# EasyEDA schematic SCH_Light-Meter-Schematic_2025-04-22 (1).json
TITLE: Light Meter Schematic; REV: 1.0; Date: 2025-03-17; Sheet: 1/1; Company: Bobi Company
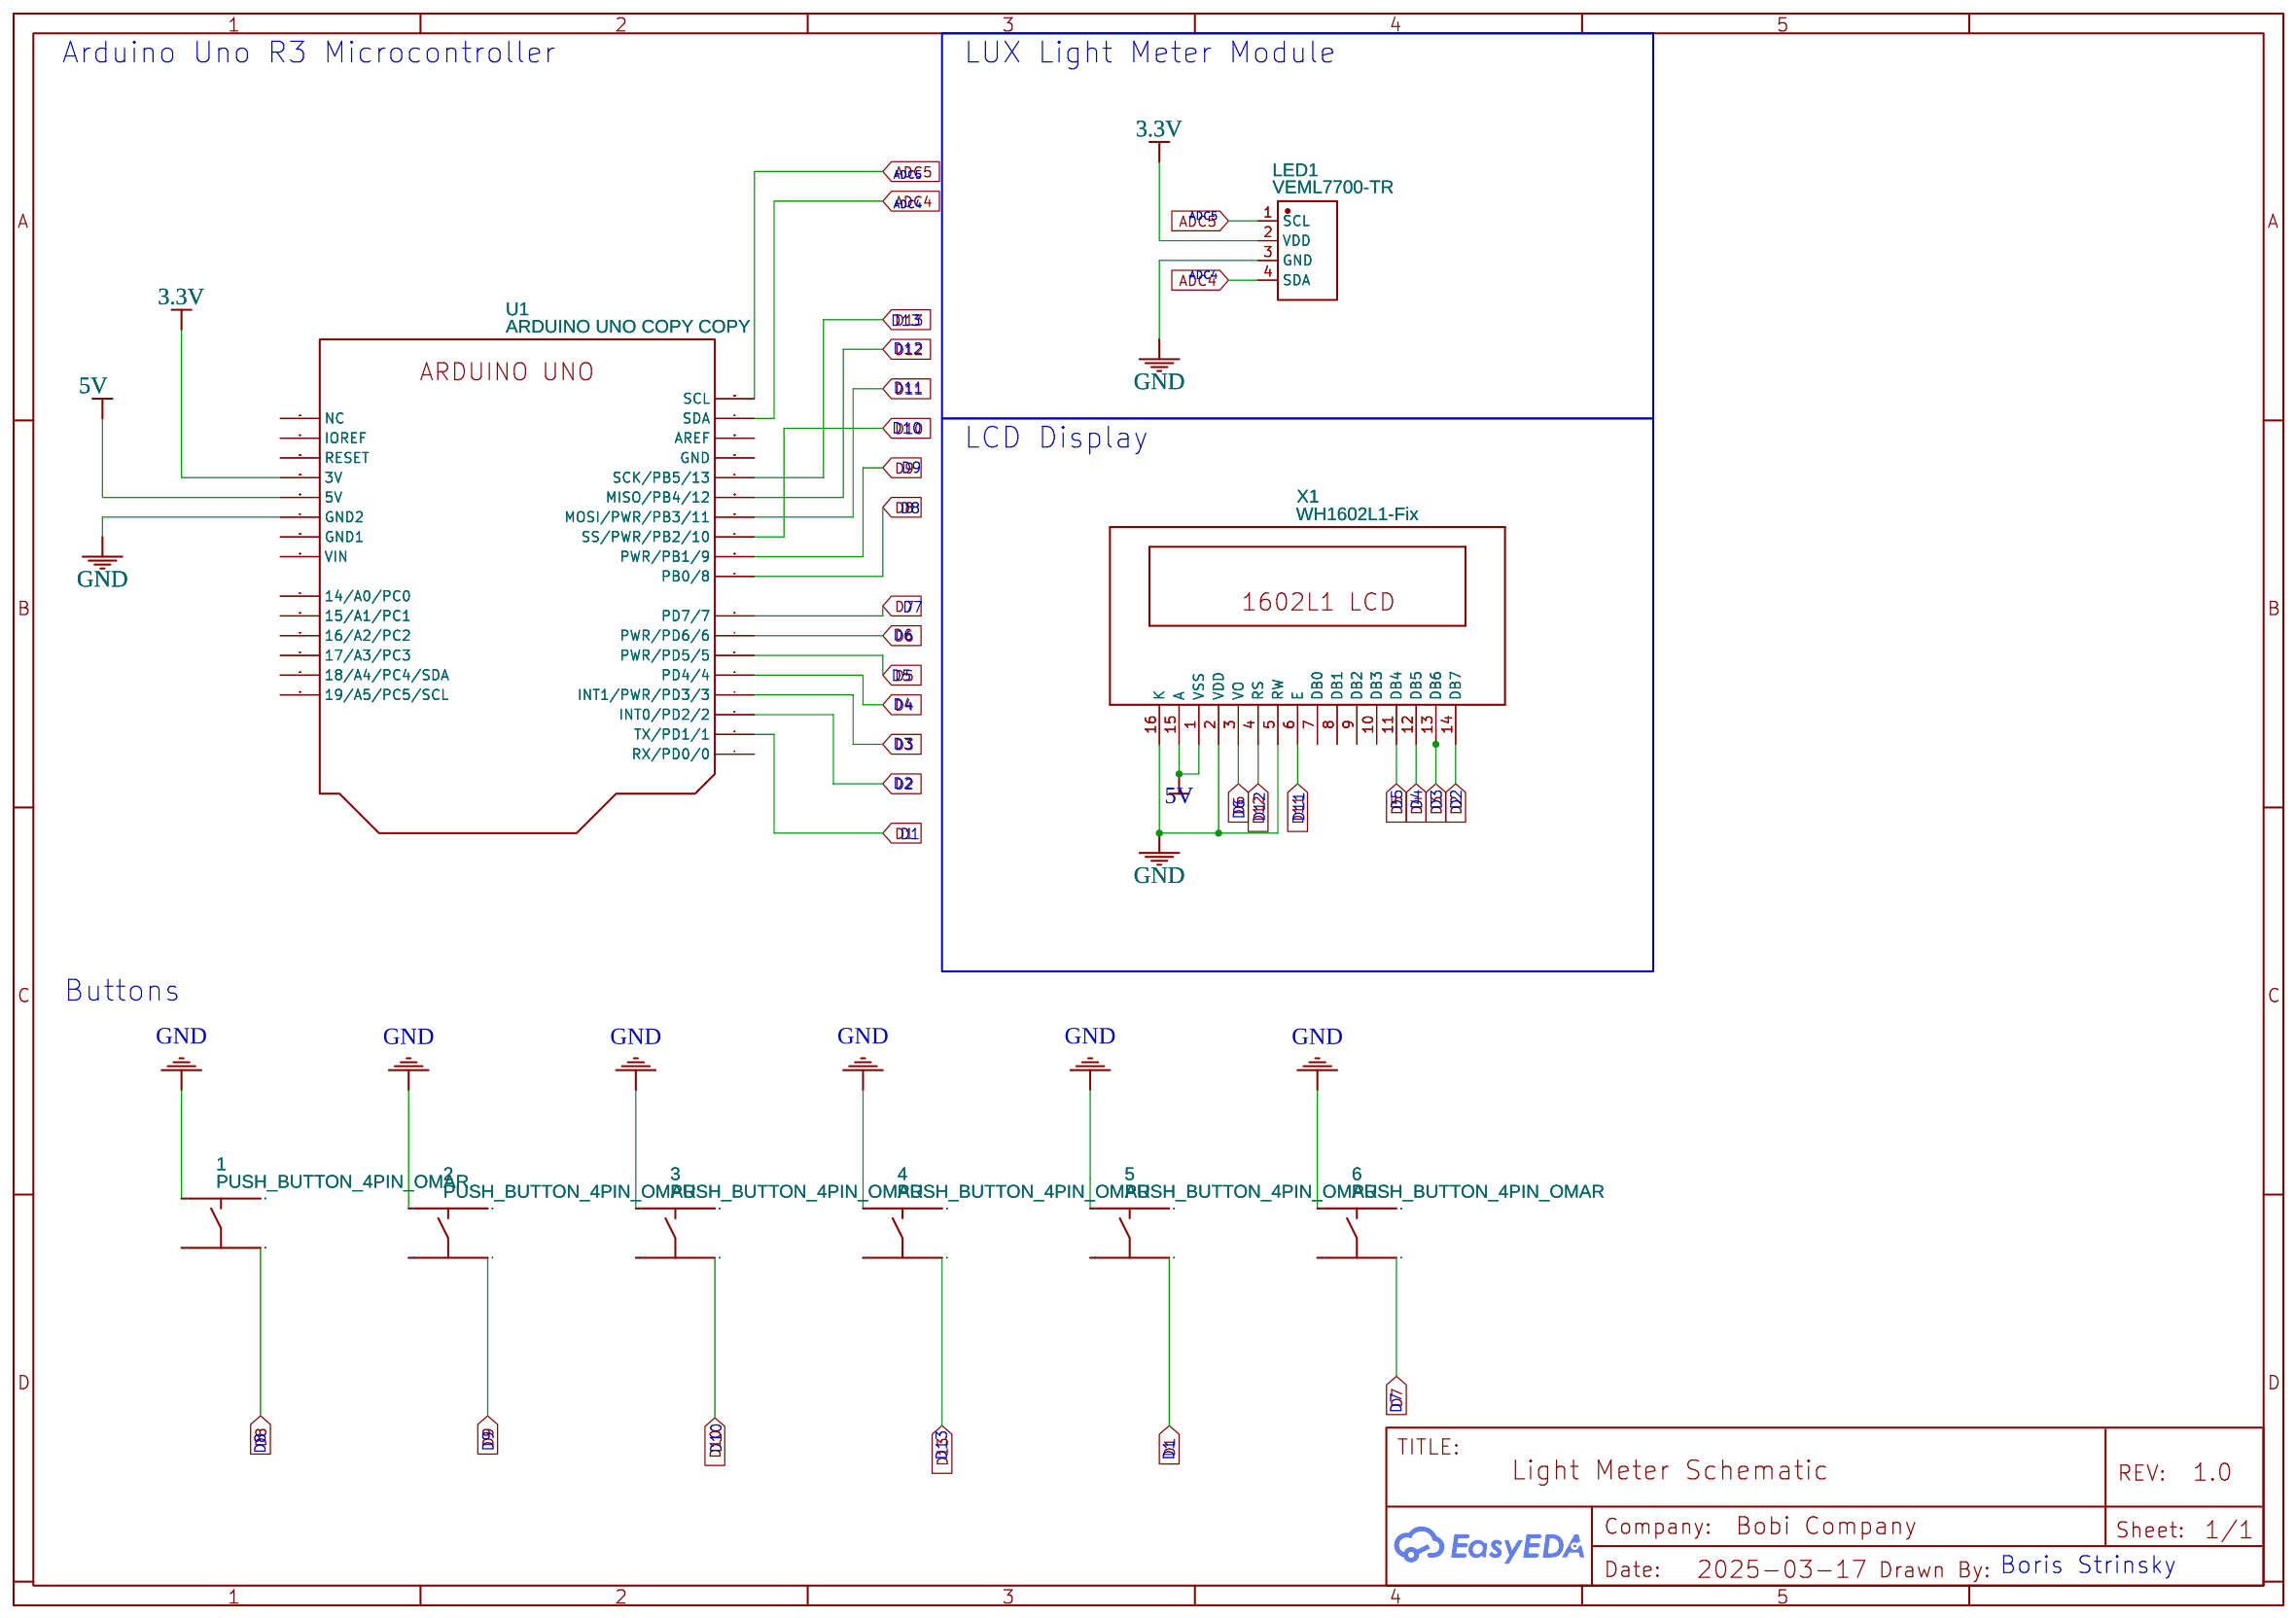
[diagram p0: schematic sheet]

## Parts
1  PUSH_BUTTON_4PIN_OMAR  [PUSHBUTTON]
2  PUSH_BUTTON_4PIN_OMAR  [PUSHBUTTON]
3  PUSH_BUTTON_4PIN_OMAR  [PUSHBUTTON]
4  PUSH_BUTTON_4PIN_OMAR  [PUSHBUTTON]
5  PUSH_BUTTON_4PIN_OMAR  [PUSHBUTTON]
6  PUSH_BUTTON_4PIN_OMAR  [PUSHBUTTON]
LED1  VEML7700-TR  [LED-SMD_4P-L6.8-W2.4_VEML7700-TR]
U1  ARDUINO UNO COPY COPY  [UNO_R3;WO ARDUINO UNO]
X1  WH1602L1-Fix  [WH1602L1 FIX]

## Library data of the parts
1-6 = PUSH_BUTTON_4PIN_OMAR: Contributor: omarsaad97
LED1 = VEML7700-TR: Contributor: lcsc; Supplier: LCSC; Supplier Part: C504893; Manufacturer: VISHAY(威世); JLCPCB Part Class: Extended Part
U1 = ARDUINO UNO COPY COPY: Contributor: malav20048; sourceId: frlCUcuMG
X1 = WH1602L1-Fix: HD44780 LCD; Contributor: vikmaster.ua; Supplier: LCSC

## Nets
3.3V: LED1.2(VDD) U1.29(3V)
5V: U1.28(5V) X1.1(VSS) X1.15(A)
GND: 1.4 2.4 3.4 4.4 5.4 6.4 LED1.3(GND) U1.27(GND2) X1.2(VDD) X1.5(RW) X1.16(K)
ADC4: LED1.4(SDA) U1.17(SDA)
ADC5: LED1.1(SCL) U1.18(SCL)
D1: 5.1 U1.2(TX/PD1/1)
D2: U1.3(INT0/PD2/2) X1.14(DB7)
D3: U1.4(INT1/PWR/PD3/3) X1.13(DB6)
D4: U1.5(PD4/4) X1.12(DB5)
D5: U1.6(PWR/PD5/5) X1.11(DB4)
D6: U1.7(PWR/PD6/6) X1.3(VO)
D7: 6.1 U1.8(PD7/7)
D8: 1.1 U1.9(PB0/8)
D9: 2.1 U1.10(PWR/PB1/9)
D10: 3.1 U1.11(SS/PWR/PB2/10)
D11: U1.12(MOSI/PWR/PB3/11) X1.6(E)
D12: U1.13(MISO/PB4/12) X1.4(RS)
D13: 4.1 U1.14(SCK/PB5/13)

Not connected (* = marked no-connect by the designer): 1 2 3; 2 2 3; 3 2 3; 4 2 3; 5 2 3; 6 2 3; U1 1(RX/PD0/0) 15(GND) 16(AREF) 19(19/A5/PC5/SCL) 20(18/A4/PC4/SDA) 21(17/A3/PC3) 22(16/A2/PC2) 23(15/A1/PC1) 24(14/A0/PC0) 25(VIN) 26(GND1) 30(RESET) 31(IOREF) 32(NC); X1 7(DB0) 8(DB1) 9(DB2) 10(DB3)

## Notes on the sheet
- Arduino Uno R3 Microcontroller
- LUX Light Meter Module
- ADC5
- ADC4
- ADC5
- ADC4
- D13
- D12
- D11
- D10
- LCD Display
- D9
- D8
- D7
- D6
- D5
- D4
- D3
- D2
- D12
- D11
- D5
- D4
- D3
- D2
- D1
- D6
- Buttons
- D7
- D8
- D9
- D10
- D13
- D1
- Boris Strinsky
